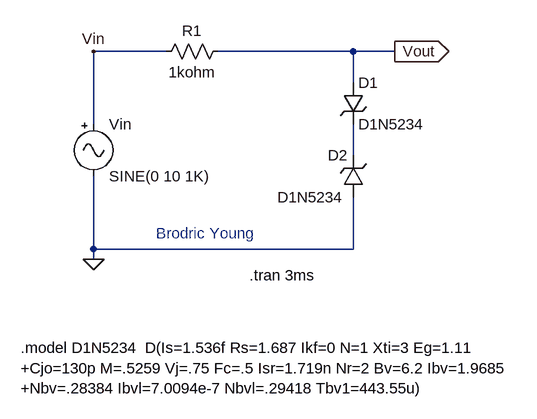
[diagram p0: schematic parallel_clipper.asc]
parallel_clipper.asc, the LTspice schematic file:
Version 4
SHEET 1 880 680
WIRE 192 32 80 32
WIRE 480 32 272 32
WIRE 544 32 480 32
WIRE 480 80 480 32
WIRE 80 144 80 32
WIRE 480 192 480 144
WIRE 80 336 80 224
WIRE 480 336 480 256
WIRE 480 336 80 336
WIRE 80 352 80 336
FLAG 80 352 0
FLAG 80 32 Vin
FLAG 544 32 Vout
IOPIN 544 32 Out
SYMBOL Misc\\signal 80 128 R0
SYMATTR InstName Vin
SYMATTR Value SINE(0 10 1K)
SYMBOL res 288 16 R90
WINDOW 0 0 56 VBottom 2
WINDOW 3 32 56 VTop 2
SYMATTR InstName R1
SYMATTR Value 1kohm
SYMBOL zener 464 80 R0
SYMATTR InstName D1
SYMATTR Value D1N5234
SYMBOL zener 496 256 R180
WINDOW 0 24 64 Left 2
WINDOW 3 133 0 Right 2
SYMATTR InstName D2
SYMATTR Value D1N5234
TEXT 320 376 Left 2 !.tran 3ms
TEXT -32 488 Left 2 !.model D1N5234  D(Is=1.536f Rs=1.687 Ikf=0 N=1 Xti=3 Eg=1.11 \n+Cjo=130p M=.5259 Vj=.75 Fc=.5 Isr=1.719n Nr=2 Bv=6.2 Ibv=1.9685 \n+Nbv=.28384 Ibvl=7.0094e-7 Nbvl=.29418 Tbv1=443.55u)
TEXT 176 312 Left 2 ;Brodric Young

The netlist it stands for:
* parallel_clipper.asc
Vin Vin 0 SINE(0 10 1K)
R1 Vout Vin 1kohm
D1 Vout N001 D1N5234
D2 0 N001 D1N5234
.model D D
.lib standard.dio
.tran 3ms
.model D1N5234  D(Is=1.536f Rs=1.687 Ikf=0 N=1 Xti=3 Eg=1.11
+Cjo=130p M=.5259 Vj=.75 Fc=.5 Isr=1.719n Nr=2 Bv=6.2 Ibv=1.9685
+Nbv=.28384 Ibvl=7.0094e-7 Nbvl=.29418 Tbv1=443.55u)
* Brodric Young
.backanno
.end

* Results of the author's LTspice run, read from the files saved beside the schematic
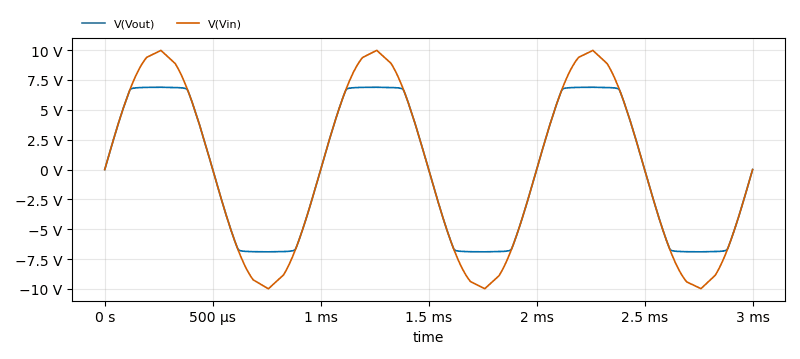
[diagram p1: Transient Analysis of parallel_clipper.asc, plotted from the saved traces]
* Transient Analysis, 1 run:
*   V(Vout): min -6.891 V, max 6.891 V, average -1.416 mV, rms 5.714 V, last -2.126 mV
*   V(Vin): min -9.986 V, max 9.98 V, average -101.4 µV, rms 7.026 V, last 0 V